# Altium schematic sheet motor2.SchDoc
size A4; SheetNumber: 7; SheetTotal: 7
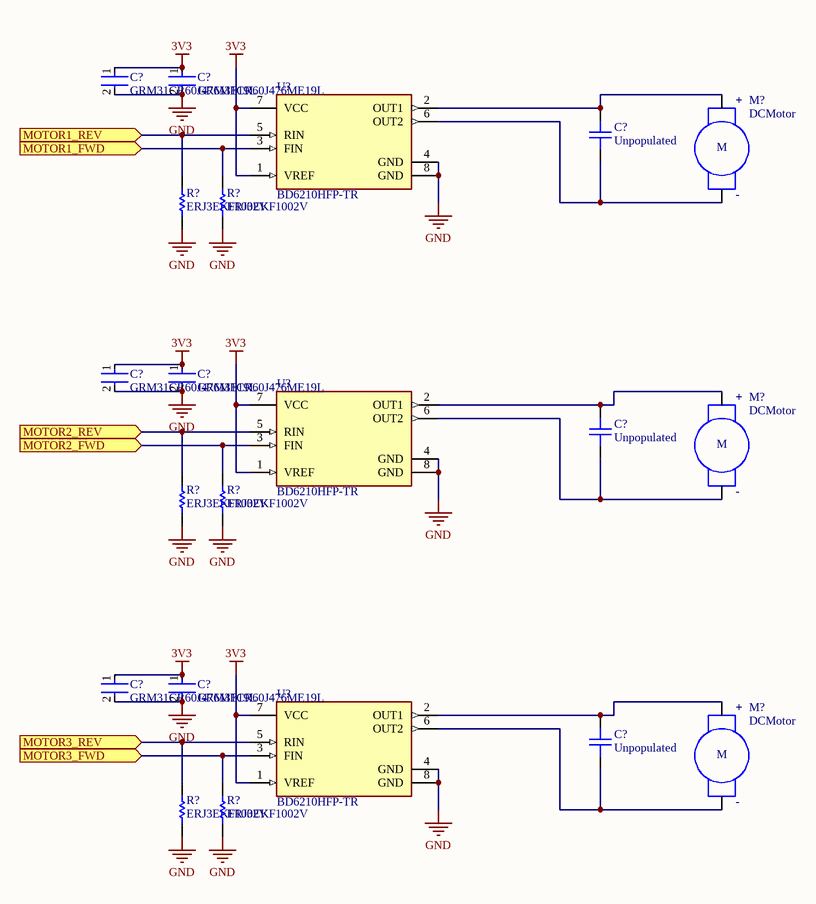
[diagram p0: motor2.SchDoc]

## Parts
(Parts that share a designator on the sheet are numbered #1, #2 ... from top to bottom, then left to right.)
C?#1  GRM31CR60J476ME19L  [FP-GRM31C-0_2-e0_3_0_8-IPC_C]
C?#2  GRM31CR60J476ME19L  [FP-GRM31C-0_2-e0_3_0_8-IPC_C]
C?#3  Unpopulated  [2012[0805]_M]
C?#4  GRM31CR60J476ME19L  [FP-GRM31C-0_2-e0_3_0_8-IPC_C]
C?#5  GRM31CR60J476ME19L  [FP-GRM31C-0_2-e0_3_0_8-IPC_C]
C?#6  Unpopulated  [2012[0805]_M]
C?#7  GRM31CR60J476ME19L  [FP-GRM31C-0_2-e0_3_0_8-IPC_C]
C?#8  GRM31CR60J476ME19L  [FP-GRM31C-0_2-e0_3_0_8-IPC_C]
C?#9  Unpopulated  [2012[0805]_M]
M?#1  DCMotor  [CABLE-TERMINAL1x2]
M?#2  DCMotor  [CABLE-TERMINAL1x2]
M?#3  DCMotor  [CABLE-TERMINAL1x2]
R?#1  ERJ3EKF1002V  [RESC1609X55X30ML15T15]
R?#2  ERJ3EKF1002V  [RESC1609X55X30ML15T15]
R?#3  ERJ3EKF1002V  [RESC1609X55X30ML15T15]
R?#4  ERJ3EKF1002V  [RESC1609X55X30ML15T15]
R?#5  ERJ3EKF1002V  [RESC1609X55X30ML15T15]
R?#6  ERJ3EKF1002V  [RESC1609X55X30ML15T15]
U?#1  BD6210HFP-TR  [FP-HRP7-MFG]
U?#2  BD6210HFP-TR  [FP-HRP7-MFG]
U?#3  BD6210HFP-TR  [FP-HRP7-MFG]

## Ports
MOTOR1_FWD (in), MOTOR1_REV (in), MOTOR2_FWD (in), MOTOR2_REV (in), MOTOR3_FWD (in), MOTOR3_REV (in)

## Nets
3V3: C?#1.1 C?#2.1 C?#4.1 C?#5.1 C?#7.1 C?#8.1 U?#1.1(VREF) U?#1.7(VCC) U?#2.1(VREF) U?#2.7(VCC) U?#3.1(VREF) U?#3.7(VCC)
GND: C?#1.2 C?#2.2 C?#4.2 C?#5.2 C?#7.2 C?#8.2 R?#1.1 R?#2.1 R?#3.1 R?#4.1 R?#5.1 R?#6.1 U?#1.4(GND) U?#1.8(GND) U?#2.4(GND) U?#2.8(GND) U?#3.4(GND) U?#3.8(GND)
MOTOR1_FWD: R?#2.2 U?#1.3(FIN) ; port MOTOR1_FWD
MOTOR1_REV: R?#1.2 U?#1.5(RIN) ; port MOTOR1_REV
MOTOR2_FWD: R?#4.2 U?#2.3(FIN) ; port MOTOR2_FWD
MOTOR2_REV: R?#3.2 U?#2.5(RIN) ; port MOTOR2_REV
MOTOR3_FWD: R?#6.2 U?#3.3(FIN) ; port MOTOR3_FWD
MOTOR3_REV: R?#5.2 U?#3.5(RIN) ; port MOTOR3_REV
NetC?#3_1: C?#3.1 M?#1.- U?#1.6(OUT2)
NetC?#3_2: C?#3.2 M?#1.+ U?#1.2(OUT1)
NetC?#6_1: C?#6.1 M?#2.- U?#2.6(OUT2)
NetC?#6_2: C?#6.2 M?#2.+ U?#2.2(OUT1)
NetC?#9_1: C?#9.1 M?#3.- U?#3.6(OUT2)
NetC?#9_2: C?#9.2 M?#3.+ U?#3.2(OUT1)

## Notes on the sheet
- (in symbol CMP-034-000000-1) M

## Library data of the parts
C?#1 C?#2 C?#4 C?#5 C?#7 C?#8 = CMP-2000-06344-2: Chip Multilayer Ceramic Capacitors for General Purpose, 1206, 47uF, X5R, 15%, 20%, 6.3V; Package Quantity: 2000; Mount: Surface Mount; Length: 3.2mm; Thickness: 0.071inch; Lead Free: Lead Free; Tolerance: 20%; Width: 0.063inch; Depth: 1.6mm; Case/Package: 1206; Dielectric: X5R; Radiation Hardening: No; Packaging: Tape and Reel; Voltage Rating (DC): 6.3V; Termination: SMD/SMT; Height: 1.6mm; Max Operating Temperature: 85°C; Case Code (Metric): 3216; Case Code (Imperial): 1206; Voltage: 6.3V; Voltage Rating: 6.3V; Capacitance: 47uF; Min Operating Temperature: -55°C; Material: Ceramic; REACH SVHC: No SVHC
C?#3 C?#6 C?#9 = Capacitor: Generic Capacitor; Value: Unpopulated
M?#1-M?#3 = CMP-034-000000-1: Generic DC motor; Source: Motor.SchLib; Design Item ID: DCMotor
R?#1-R?#6 = CMP-1012-00623-3: Chip Resistor, 10 KOhm, +/- 1%, 0.1 W, -55 to 155 degC, 0603 (1608 Metric), RoHS, Tape and Reel; Manufacturer: Panasonic; Voltage Rating: 75V; Case\/Package: 0603; Power Rating: 100mW; Resistance: 10KOhm; Temperature Coefficient: 100ppm\/degreesC; Number of Pins: 2; Package Reference: 603; Depth: 0.8mm; Mount: SurfaceMount; Package Description: 2-Pin Surface Mount Device, Body 1.6 x 0.85 mm; Datasheet Version: 02/2017; Length: 1.6mm; Lead Free: LeadFree; Height: 0.45mm; Number of Terminations: 2; Max Power Dissipation: 100mW; Min Operating Temperature: -55degC; Datasheet URL: https://industrial.panasonic.com/cdbs/www-data/pdf/RDA0000/AOA0000C304.pdf; Termination: SMD/SMT; Case Code (Metric): 1608; Case Code (Imperial): 0603; Tolerance: 1%; Max Operating Temperature: 155degC; RoHSCompliant: true; Voltage Rating (DC): 75V; Radiation Hardening: No; Packaging: TapeandReel; Composition: ThickFilm; Mounting Technology: SurfaceMount; Manufacturer URL: http://www.panasonic.com/; Width: 0.031inch; REACH SVHC: NoSVHC; Contact Plating: Tin; Military Standard: Not; Package Quantity: 1
U?#1-U?#3 = CMP-08935-000017-1: IC MOTOR DRIVER 3V-5.5V HRP7; Interface: On/Off; Nominal Supply Current: 1.5mA; Logic Function: AND GATE; Number of Outputs: 1; Max Supply Voltage: 5.5V; Output Current: 500mA; Number of Pins: 8; RoHS Compliant: Yes; Package Quantity: 2000; Max Operating Temperature: 85°C; Min Operating Temperature: -40°C; Lead Free: Lead Free; Radiation Hardening: No; Mount: Surface Mount; Packaging: Tape and Reel; Supply Current: 1.5mA; Case/Package: TO-263-8